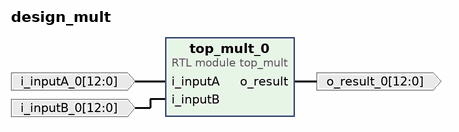
[diagram p0: block diagram of the top level]
# Vivado block design design_mult, xc7a12ticsg325-1L, Vivado 2024.2
create_bd_design design_mult

create_bd_port -dir I -from 12 -to 0 i_inputA_0
create_bd_port -dir I -from 12 -to 0 i_inputB_0
create_bd_port -dir O -from 12 -to 0 o_result_0

create_bd_cell -type module -reference top_mult top_mult_0

# ---- connections ----

connect_bd_net -net i_inputA_0_1 [get_bd_ports i_inputA_0] [get_bd_pins top_mult_0/i_inputA]
connect_bd_net -net i_inputB_0_1 [get_bd_ports i_inputB_0] [get_bd_pins top_mult_0/i_inputB]
connect_bd_net [get_bd_pins top_mult_0/o_result] [get_bd_ports o_result_0]

validate_bd_design
save_bd_design
